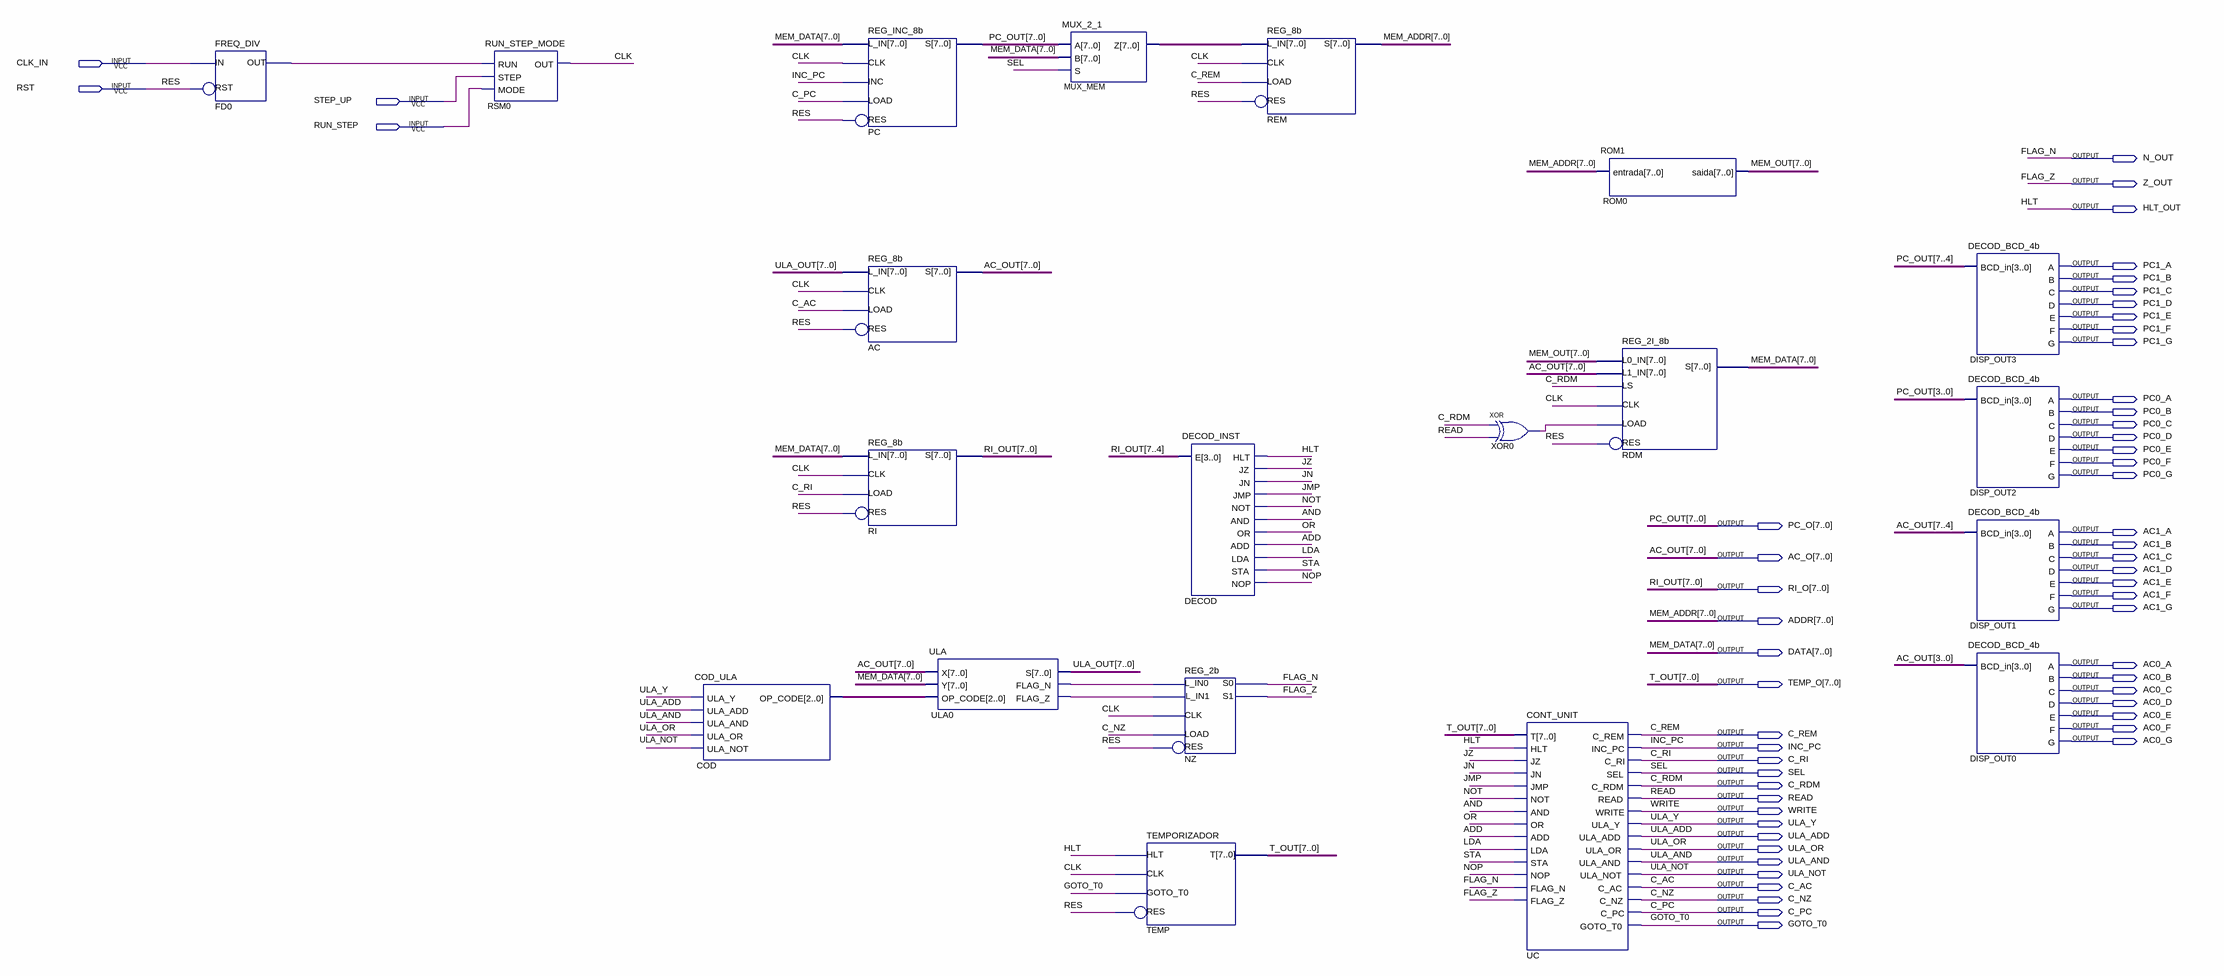
[diagram p0: schematic sheet]
// Quartus schematic PROJETO_NEANDER.bdf as structural Verilog: 20 symbols, 57 pins
module PROJETO_NEANDER (
  input  CLK_IN,
  input  RST,
  input  STEP_UP,
  input  RUN_STEP,
  output N_OUT,
  output Z_OUT,
  output HLT_OUT,
  output PC1_A,
  output PC1_B,
  output PC1_C,
  output PC1_D,
  output PC1_E,
  output PC1_F,
  output PC1_G,
  output PC0_A,
  output PC0_B,
  output PC0_C,
  output PC0_D,
  output PC0_E,
  output PC0_F,
  output PC0_G,
  output [7:0] PC_O,
  output AC1_A,
  output AC1_B,
  output [7:0] AC_O,
  output AC1_C,
  output AC1_D,
  output AC1_E,
  output [7:0] RI_O,
  output AC1_F,
  output AC1_G,
  output [7:0] ADDR,
  output [7:0] DATA,
  output AC0_A,
  output AC0_B,
  output [7:0] TEMP_O,
  output AC0_C,
  output AC0_D,
  output AC0_E,
  output AC0_F,
  output C_REM,
  output AC0_G,
  output INC_PC,
  output C_RI,
  output SEL,
  output C_RDM,
  output READ,
  output WRITE,
  output ULA_Y,
  output ULA_ADD,
  output ULA_OR,
  output ULA_AND,
  output ULA_NOT,
  output C_AC,
  output C_NZ,
  output C_PC,
  output GOTO_T0
);

  wire ADD, AND, CLK, FD0_out, JMP, JN, JZ, LDA, NOP, NOT, OR, STA, ULA0_flag_n, ULA0_flag_z, XOR0_out;
  wire [2:0] COD_op_code;
  wire [7:0] MEM_OUT, MUX_MEM_z, ULA_OUT;

  FREQ_DIV FD0 (.IN(CLK_IN), .RST(RST), .OUT(FD0_out));
  RUN_STEP_MODE RSM0 (.RUN(FD0_out), .STEP(STEP_UP), .MODE(RUN_STEP), .OUT(CLK));
  COD_ULA COD (
    .ULA_Y(ULA_Y), .ULA_ADD(ULA_ADD), .ULA_AND(ULA_AND), .ULA_OR(ULA_OR), .ULA_NOT(ULA_NOT),
    .OP_CODE(COD_op_code));
  REG_INC_8b PC (.L_IN(DATA), .INC(INC_PC), .LOAD(C_PC), .CLK(CLK), .RES(RST), .S(PC_O));
  REG_8b AC (.L_IN(ULA_OUT), .LOAD(C_AC), .CLK(CLK), .RES(RST), .S(AC_O));
  REG_8b RI (.L_IN(DATA), .LOAD(C_RI), .CLK(CLK), .RES(RST), .S(RI_O));
  ULA ULA0 (.X(AC_O), .Y(DATA), .OP_CODE(COD_op_code), .S(ULA_OUT), .FLAG_N(ULA0_flag_n), .FLAG_Z(ULA0_flag_z));
  MUX_2_1 MUX_MEM (.A(PC_O), .B(DATA), .S(SEL), .Z(MUX_MEM_z));
  TEMPORIZADOR TEMP (.HLT(HLT_OUT), .CLK(CLK), .GOTO_T0(GOTO_T0), .RES(RST), .T(TEMP_O));
  REG_2b NZ (.L_IN0(ULA0_flag_n), .L_IN1(ULA0_flag_z), .LOAD(C_NZ), .CLK(CLK), .RES(RST), .S0(N_OUT), .S1(Z_OUT));
  DECOD_INST DECOD (
    .E(RI_O[7:4]), .HLT(HLT_OUT), .JZ(JZ), .JN(JN), .JMP(JMP), .NOT(NOT), .AND(AND), .OR(OR), .ADD(ADD),
    .LDA(LDA), .STA(STA), .NOP(NOP));
  REG_8b REM (.L_IN(MUX_MEM_z), .LOAD(C_REM), .CLK(CLK), .RES(RST), .S(ADDR));
  xor XOR0 (XOR0_out, C_RDM, READ);
  CONT_UNIT UC (
    .T(TEMP_O), .HLT(HLT_OUT), .JZ(JZ), .JN(JN), .JMP(JMP), .NOT(NOT), .AND(AND), .OR(OR), .ADD(ADD),
    .LDA(LDA), .STA(STA), .NOP(NOP), .FLAG_N(N_OUT), .FLAG_Z(Z_OUT), .C_REM(C_REM), .INC_PC(INC_PC),
    .C_RI(C_RI), .SEL(SEL), .C_RDM(C_RDM), .READ(READ), .WRITE(WRITE), .ULA_Y(ULA_Y), .ULA_OR(ULA_OR),
    .ULA_NOT(ULA_NOT), .ULA_AND(ULA_AND), .C_AC(C_AC), .C_NZ(C_NZ), .C_PC(C_PC), .GOTO_T0(GOTO_T0),
    .ULA_ADD(ULA_ADD));
  ROM1 ROM0 (.entrada(ADDR), .saida(MEM_OUT));
  REG_2I_8b RDM (.L0_IN(MEM_OUT), .L1_IN(AC_O), .LS(C_RDM), .LOAD(XOR0_out), .CLK(CLK), .RES(RST), .S(DATA));
  DECOD_BCD_4b DISP_OUT3 (
    .BCD_in(PC_O[7:4]), .A(PC1_A), .B(PC1_B), .C(PC1_C), .D(PC1_D), .E(PC1_E), .F(PC1_F), .G(PC1_G));
  DECOD_BCD_4b DISP_OUT2 (
    .BCD_in(PC_O[3:0]), .A(PC0_A), .B(PC0_B), .C(PC0_C), .D(PC0_D), .E(PC0_E), .F(PC0_F), .G(PC0_G));
  DECOD_BCD_4b DISP_OUT1 (
    .BCD_in(AC_O[7:4]), .A(AC1_A), .B(AC1_B), .C(AC1_C), .D(AC1_D), .E(AC1_E), .F(AC1_F), .G(AC1_G));
  DECOD_BCD_4b DISP_OUT0 (
    .BCD_in(AC_O[3:0]), .A(AC0_A), .B(AC0_B), .C(AC0_C), .D(AC0_D), .E(AC0_E), .F(AC0_F), .G(AC0_G));

  // Other names for the same wires on the sheet: AC_OUT[7:0] = AC_O; FLAG_N = N_OUT; FLAG_Z = Z_OUT; HLT = HLT_OUT;
  //   MEM_ADDR[7:0] = ADDR; MEM_DATA[7:0] = DATA; PC_OUT[7:0] = PC_O; RES = RST; RI_OUT[7:0] = RI_O;
  //   T_OUT[7:0] = TEMP_O
endmodule
